# Altium schematic sheet PDOC.SchDoc
size A4
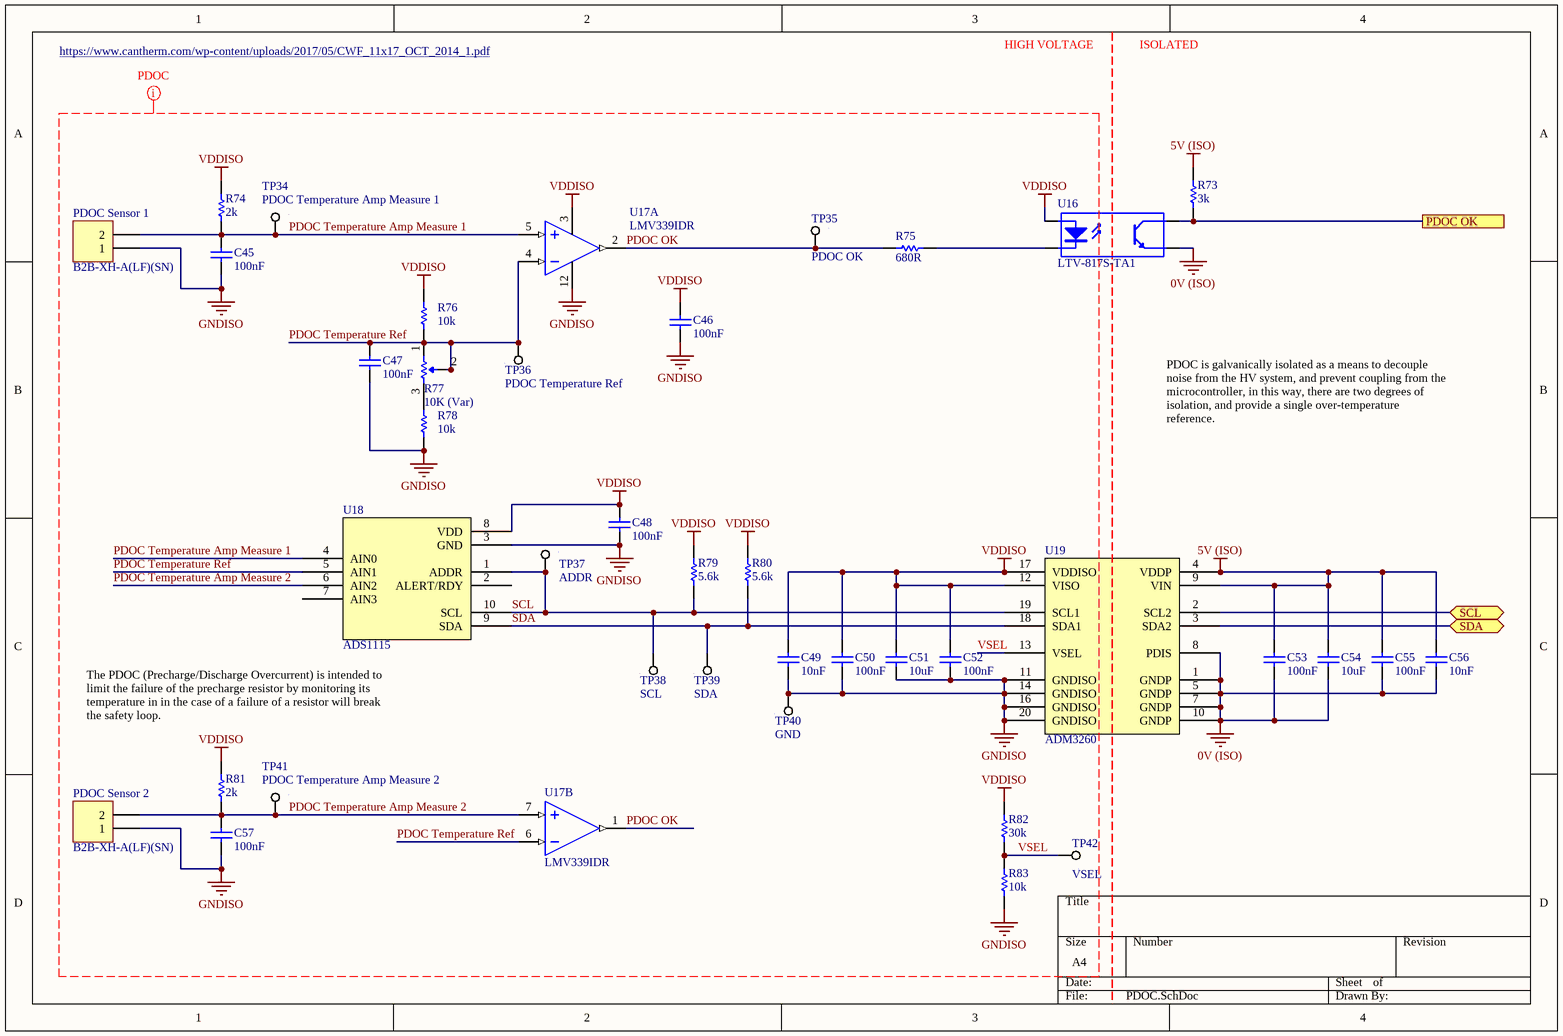
[diagram p0: PDOC.SchDoc]

## Parts
C45  100nF  [0805]
C46  100nF  [0805]
C47  100nF  [0805]
C48  100nF  [0805]
C49  10nF  [0805]
C50  100nF  [0805]
C51  10uF  [0805]
C52  100nF  [0805]
C53  100nF  [0805]
C54  10uF  [0805]
C55  100nF  [0805]
C56  10nF  [0805]
C57  100nF  [0805]
PDOC_Sensor_1  B2B-XH-A(LF)(SN)  [XH 2 PIN VERT]
PDOC_Sensor_2  B2B-XH-A(LF)(SN)  [XH 2 PIN VERT]
R73  3k  [0805]
R74  2k  [0805]
R75  680R  [0805]
R76  10k  [0805]
R77  10K (Var)  [B 3296]
R78  10k  [0805]
R79  5.6k  [0805]
R80  5.6k  [0805]
R81  2k  [0805]
R82  30k  [0805]
R83  10k  [0805]
TP34  PDOC Temperature Amp Measure 1  [SMD Test Point 1mm]
TP35  PDOC OK  [SMD Test Point 1mm]
TP36  PDOC Temperature Ref  [SMD Test Point 1mm]
TP37  ADDR  [SMD Test Point 1mm]
TP38  SCL  [SMD Test Point 1mm]
TP39  SDA  [SMD Test Point 1mm]
TP40  GND  [SMD Test Point 1mm]
TP41  PDOC Temperature Amp Measure 2  [SMD Test Point 1mm]
TP42  VSEL  [SMD Test Point 1mm]
U16  LTV-817S-TA1  [ON 4-SMD]
U17  LMV339IDR  [TI 14-SOIC]  (parts A,B of 4)
U18  ADS1115  [TI 10-VSSOP]
U19  ADM3260  [AD 20-SSOP]

## Ports
PDOC OK, SCL (bidir), SDA (bidir)

## Nets
0V (ISO): C53.1 C54.1 C55.1 C56.1 U16.3(E) U19.1(GNDP) U19.5(GNDP) U19.7(GNDP) U19.8(PDIS) U19.10(GNDP)
5V (ISO): C53.2 C54.2 C55.2 C56.2 R73.2 U19.4(VDDP) U19.9(VIN)
GNDISO: C45.1 C46.1 C47.1 C48.2 C49.1 C50.1 C51.1 C52.2 C57.1 PDOC_Sensor_1.1 PDOC_Sensor_2.1 R78.1 R83.1 TP40.1 U17.12(V-) U18.3(GND) U19.11(GNDISO) U19.14(GNDISO) U19.16(GNDISO) U19.20(GNDISO)
VDDISO: C46.2 C48.1 C49.2 C50.2 C51.2 C52.1 R74.2 R76.2 R79.2 R80.2 R81.2 R82.2 U16.1(A) U17.3(V+) U18.8(VDD) U19.12(VISO) U19.17(VDDISO)
PDOC OK: R73.1 U16.4(C) ; port PDOC OK
PDOC OK: R75.1 TP35.1 U17.1(OUT_B) U17.2(OUT_A)  [a separate net that carries the same name]
PDOC Temperature Amp Measure 1: C45.2 PDOC_Sensor_1.2 R74.1 TP34.1 U17.5(IN_A+) U18.4(AIN0)
PDOC Temperature Amp Measure 2: C57.2 PDOC_Sensor_2.2 R81.1 TP41.1 U17.7(IN_B+) U18.6(AIN2)
PDOC Temperature Ref: C47.2 R76.1 R77.1(CCW) R77.2(Wiper) TP36.1 U17.4(IN_A-) U17.6(IN_B-) U18.5(AIN1)
SCL: R79.1 TP37.1 TP38.1 U18.1(ADDR) U18.10(SCL) U19.19(SCL1)
SCL: U19.2(SCL2) ; port SCL  [a separate net that carries the same name]
SDA: R80.1 TP39.1 U18.9(SDA) U19.18(SDA1)
SDA: U19.3(SDA2) ; port SDA  [a separate net that carries the same name]
VSEL: R82.1 R83.2 TP42.1 U19.13(VSEL)
NetR75_2: R75.2 U16.2(K)
NetR77_3: R77.3(CW) R78.2

Not connected (* = marked no-connect by the designer): U18 2(ALERT/RDY) 7(AIN3)

## Layout directives
net class PDOC (ISO): GNDISO, PDOC OK, PDOC Temperature Amp Measure 1, PDOC Temperature Amp Measure 2, PDOC Temperature Ref, SCL, SDA, VDDISO, VSEL

## Notes on the sheet
- https://www.cantherm.com/wp-content/uploads/2017/05/CWF_11x17_OCT_2014_1.pdf
- HIGH VOLTAGE
- ISOLATED
- PDOC is galvanically isolated as a means to decouple noise from the HV system, and prevent coupling from the microcontroller, in this way, there are two degrees of isolation, and provide a single over-temperature reference.
- The PDOC (Precharge/Discharge Overcurrent) is intended to limit the failure of the precharge resistor by monitoring its temperature in in the case of a failure of a resistor will break the safety loop.

## Library data of the parts
C45-C48 C50 C52 C53 C55 C57 = GCM21BR71H104KA37L: Manufacturer: muRata; Tolerance: ±10%; Material: X7R; Rated Voltage: 50V; Part Number: GCM21BR71H104KA37L; Value: 100nF; Digikey Part Number: 490-6064-1-ND
C49 C56 = GCM2195C1H103JA16D: Manufacturer: muRata; Tolerance: ±5%; Material: C0G, NP0; Rated Voltage: 50V; Part Number: GCM2195C1H103JA16D; Value: 10nF; Digikey Part Number: 490-4783-1-ND
C51 C54 = GRM21BR6YA106KE43L: Manufacturer: muRata; Tolerance: 10%; Material: X5R; Rated Voltage: 50V; Part Number: GRM21BR6YA106KE43L; Value: 10uF; Digikey Part Number: 490-10514-6-ND
PDOC_Sensor_1 PDOC_Sensor_2 = B2B-XH-A(LF)(SN): Positions: 2; Pitch: 2.54mm; Angle: 0; Flange: No; Contact: Tin; Part Number: B2B-XH-A(LF)(SN); Row Spacing: 2.54mm; Digikey Part Number: 455-2247-ND; Digikey Link: https://www.digikey.com.au/en/products/detail/jst-sales-america-inc/B2B-XH-A-LF-SN/1651045
R73 = RC0805FR073KL: Manufacturer: YAGEO; Tolerance: 0.01; Rated Voltage: 0.125W; Part Number: RC0805FR073KL; Value: 3k; Material: FR-07; Digikey Part Number: 311-3.00KCRCT-ND
R74 R81 = RC0805FR072KL: Manufacturer: YAGEO; Tolerance: 0.01; Rated Voltage: 0.125W; Part Number: RC0805FR072KL; Value: 2k; Material: FR-07; Digikey Part Number: 311-2.00KCRCT-ND
R75 = RC0805FR07680RL: Manufacturer: YAGEO; Tolerance: 0.01; Rated Voltage: 0.125W; Part Number: RC0805FR07680RL; Value: 680R; Material: FR-07; Digikey Part Number: 311-680CRCT-ND
R76 R78 R83 = RC0805FR0710KL: Manufacturer: YAGEO; Tolerance: 0.01; Rated Voltage: 0.125W; Part Number: RC0805FR0710KL; Value: 10k; Material: FR-07; Digikey Part Number: 311-10.0KCRCT-ND
R77 = 3296W-1-103LF: Manufacturer: Bournes Inc; Tolerance: 0.1; Rated Voltage: 0.5W; Part Number: 3296W-1-103LF; Value: 10K (Var); Digikey Part Number: 3296W-103LF-ND
R79 R80 = RC0805FR075K6L: Manufacturer: YAGEO; Tolerance: 0.01; Rated Voltage: 0.125W; Part Number: RC0805FR075K6L; Value: 5.6k; Material: FR-07; Digikey Part Number: 311-5.60KCRCT-ND
R82 = RC0805FR0730KL: Manufacturer: YAGEO; Tolerance: 0.01; Rated Voltage: 0.125W; Part Number: RC0805FR0730KL; Value: 30k; Material: FR-07; Digikey Part Number: 311-30.0KCRCT-ND
TP34-TP42 = SMD Test Point Small: Positions: 1; Pitch: 0mm; Row Spacing: 0; Flange: No; Contact: NA; Part Number: SMD Test Point Small; Angle: 0
U16 = LTV-817S-TA1: 35V 50ma Optocoupler (VF=1.2V); Manufacturer: Lite-On Inc; Part Number: LTV-817S-TA1; Digikey Part Number: 160-1893-2-ND; Digikey Link: https://www.digikey.com/product-detail/en/lite-on-inc/LTV-817S-TA1/160-1893-2-ND/388451
U17 = LMV339IDR: Comparator General Purpose Open Collector 14-SOIC; Manufacturer: Texas Instruments; Part Number: LMV339IDR; Digikey Part Number: 296-6611-2-ND; Digikey Link: https://www.digikey.com/product-detail/en/texas-instruments/LMV339MTX-NOPB/296-35446-1-ND/3739150
U18 = ADS1115: 16 Bit Analog to Digital Converter 2, 4 Input 1 Sigma-Delta 10-VSSOP; Manufacturer: Texas Instruments; Part Number: ADS1115; Digikey Part Number: 296-38849-1-ND; Digikey Link: https://www.digikey.com/product-detail/en/texas-instruments/ADS1115IDGSR/296-38849-1-ND/5142969
U19 = ADM3260: I²C Digital Isolator 2500Vrms 2 Channel 25kV/µs CMTI 20-SSOP (0.209", 5.30mm Width); Manufacturer: Analog Devices; Part Number: ADM3260; Digikey Part Number: ADM3260ARSZ-RL7CT-ND; Digikey Link: https://www.digikey.com/product-detail/en/analog-devices-inc/ADM3260ARSZ-RL7/ADM3260ARSZ-RL7CT-ND/5233040